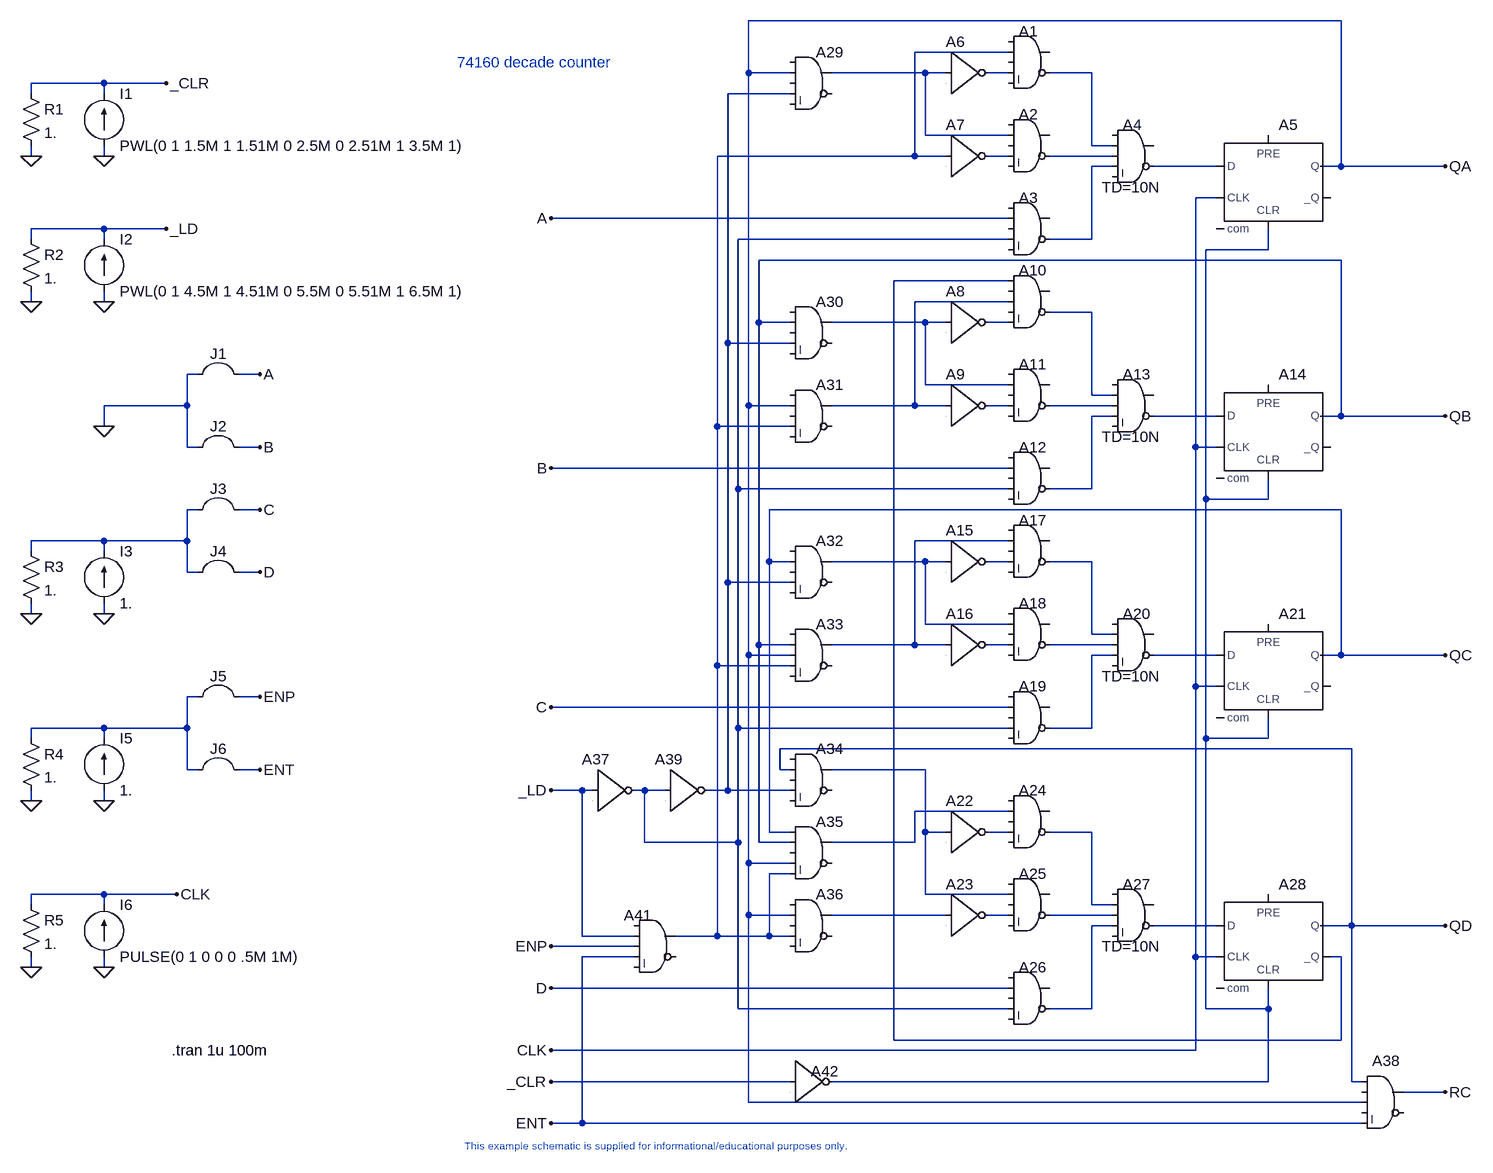
[diagram p0: schematic 160.asc]
160.asc, the LTspice schematic file:
Version 4
SHEET 1 2604 1992
WIRE 2384 208 1472 208
WIRE 1872 256 1728 256
WIRE 1472 288 1472 208
WIRE 1536 288 1472 288
WIRE 1744 288 1600 288
WIRE 1776 288 1744 288
WIRE 1872 288 1840 288
WIRE 2000 288 1936 288
WIRE 480 304 368 304
WIRE 576 304 480 304
WIRE 368 320 368 304
WIRE 480 320 480 304
WIRE 1536 320 1440 320
WIRE 1744 384 1744 288
WIRE 1872 384 1744 384
WIRE 2000 400 2000 288
WIRE 2032 400 2000 400
WIRE 368 416 368 400
WIRE 480 416 480 400
WIRE 1728 416 1728 256
WIRE 1728 416 1424 416
WIRE 1776 416 1728 416
WIRE 1872 416 1840 416
WIRE 2032 416 1936 416
WIRE 2032 432 2000 432
WIRE 2192 432 2096 432
WIRE 2384 432 2384 208
WIRE 2384 432 2352 432
WIRE 2544 432 2384 432
WIRE 2192 480 2160 480
WIRE 1872 512 1168 512
WIRE 480 528 368 528
WIRE 576 528 480 528
WIRE 368 544 368 528
WIRE 480 544 480 528
WIRE 1872 544 1456 544
WIRE 2000 544 2000 432
WIRE 2000 544 1936 544
WIRE 2272 560 2272 528
WIRE 2272 560 2176 560
WIRE 2384 576 1488 576
WIRE 1872 608 1696 608
WIRE 368 640 368 624
WIRE 480 640 480 624
WIRE 1872 640 1728 640
WIRE 2000 656 1936 656
WIRE 1488 672 1488 576
WIRE 1536 672 1488 672
WIRE 1744 672 1600 672
WIRE 1776 672 1744 672
WIRE 1872 672 1840 672
WIRE 1440 704 1440 320
WIRE 1536 704 1440 704
WIRE 624 752 608 752
WIRE 720 752 688 752
WIRE 1744 768 1744 672
WIRE 1872 768 1744 768
WIRE 2000 784 2000 656
WIRE 2032 784 2000 784
WIRE 608 800 608 752
WIRE 608 800 480 800
WIRE 1472 800 1472 288
WIRE 1536 800 1472 800
WIRE 1728 800 1728 640
WIRE 1728 800 1600 800
WIRE 1776 800 1728 800
WIRE 1872 800 1840 800
WIRE 2032 800 1936 800
WIRE 2032 816 2000 816
WIRE 2192 816 2096 816
WIRE 2384 816 2384 576
WIRE 2384 816 2352 816
WIRE 2544 816 2384 816
WIRE 480 832 480 800
WIRE 1424 832 1424 416
WIRE 1536 832 1424 832
WIRE 608 864 608 800
WIRE 624 864 608 864
WIRE 720 864 688 864
WIRE 2160 864 2160 480
WIRE 2192 864 2160 864
WIRE 1872 896 1168 896
WIRE 1456 928 1456 544
WIRE 1872 928 1456 928
WIRE 2000 928 2000 816
WIRE 2000 928 1936 928
WIRE 2176 944 2176 560
WIRE 2272 944 2272 912
WIRE 2272 944 2176 944
WIRE 624 960 608 960
WIRE 720 960 688 960
WIRE 2384 960 1504 960
WIRE 480 1008 368 1008
WIRE 608 1008 608 960
WIRE 608 1008 480 1008
WIRE 1872 1008 1728 1008
WIRE 368 1024 368 1008
WIRE 480 1024 480 1008
WIRE 1504 1040 1504 960
WIRE 1536 1040 1504 1040
WIRE 1744 1040 1600 1040
WIRE 1776 1040 1744 1040
WIRE 1872 1040 1840 1040
WIRE 2000 1040 1936 1040
WIRE 608 1056 608 1008
WIRE 624 1056 608 1056
WIRE 720 1056 688 1056
WIRE 1440 1072 1440 704
WIRE 1536 1072 1440 1072
WIRE 368 1120 368 1104
WIRE 480 1120 480 1104
WIRE 1744 1136 1744 1040
WIRE 1872 1136 1744 1136
WIRE 2000 1152 2000 1040
WIRE 2032 1152 2000 1152
WIRE 1488 1168 1488 672
WIRE 1536 1168 1488 1168
WIRE 1728 1168 1728 1008
WIRE 1728 1168 1600 1168
WIRE 1776 1168 1728 1168
WIRE 1872 1168 1840 1168
WIRE 2032 1168 1936 1168
WIRE 1472 1184 1472 800
WIRE 1536 1184 1472 1184
WIRE 2032 1184 2000 1184
WIRE 2192 1184 2096 1184
WIRE 2384 1184 2384 960
WIRE 2384 1184 2352 1184
WIRE 2544 1184 2384 1184
WIRE 1424 1200 1424 832
WIRE 1536 1200 1424 1200
WIRE 2160 1232 2160 864
WIRE 2192 1232 2160 1232
WIRE 624 1248 608 1248
WIRE 720 1248 688 1248
WIRE 1872 1264 1168 1264
WIRE 480 1296 368 1296
WIRE 608 1296 608 1248
WIRE 608 1296 480 1296
WIRE 1456 1296 1456 928
WIRE 1872 1296 1456 1296
WIRE 2000 1296 2000 1184
WIRE 2000 1296 1936 1296
WIRE 368 1312 368 1296
WIRE 480 1312 480 1296
WIRE 2176 1312 2176 944
WIRE 2272 1312 2272 1280
WIRE 2272 1312 2176 1312
WIRE 2400 1328 1520 1328
WIRE 608 1360 608 1296
WIRE 624 1360 608 1360
WIRE 720 1360 688 1360
WIRE 1520 1360 1520 1328
WIRE 1536 1360 1520 1360
WIRE 1744 1360 1600 1360
WIRE 1216 1392 1168 1392
WIRE 1232 1392 1216 1392
WIRE 1312 1392 1296 1392
WIRE 1344 1392 1312 1392
WIRE 1440 1392 1440 1072
WIRE 1440 1392 1408 1392
WIRE 1536 1392 1440 1392
WIRE 368 1408 368 1392
WIRE 480 1408 480 1392
WIRE 1872 1424 1728 1424
WIRE 1504 1456 1504 1040
WIRE 1536 1456 1504 1456
WIRE 1744 1456 1744 1360
WIRE 1776 1456 1744 1456
WIRE 1872 1456 1840 1456
WIRE 2000 1456 1936 1456
WIRE 1312 1472 1312 1392
WIRE 1456 1472 1456 1296
WIRE 1456 1472 1312 1472
WIRE 1488 1472 1488 1168
WIRE 1536 1472 1488 1472
WIRE 1728 1472 1728 1424
WIRE 1728 1472 1600 1472
WIRE 1472 1504 1472 1184
WIRE 1536 1504 1472 1504
WIRE 1536 1520 1504 1520
WIRE 480 1552 368 1552
WIRE 592 1552 480 1552
WIRE 1744 1552 1744 1456
WIRE 1872 1552 1744 1552
WIRE 368 1568 368 1552
WIRE 480 1568 480 1552
WIRE 2000 1568 2000 1456
WIRE 2032 1568 2000 1568
WIRE 1472 1584 1472 1504
WIRE 1536 1584 1472 1584
WIRE 1776 1584 1600 1584
WIRE 1872 1584 1840 1584
WIRE 2032 1584 1936 1584
WIRE 2032 1600 2000 1600
WIRE 2192 1600 2096 1600
WIRE 2400 1600 2400 1328
WIRE 2400 1600 2352 1600
WIRE 2544 1600 2400 1600
WIRE 1216 1616 1216 1392
WIRE 1296 1616 1216 1616
WIRE 1424 1616 1424 1200
WIRE 1424 1616 1360 1616
WIRE 1504 1616 1504 1520
WIRE 1504 1616 1424 1616
WIRE 1536 1616 1504 1616
WIRE 1296 1632 1168 1632
WIRE 1296 1648 1216 1648
WIRE 2160 1648 2160 1232
WIRE 2192 1648 2160 1648
WIRE 2384 1648 2368 1648
WIRE 368 1664 368 1648
WIRE 480 1664 480 1648
WIRE 1872 1696 1168 1696
WIRE 1456 1728 1456 1472
WIRE 1872 1728 1456 1728
WIRE 2000 1728 2000 1600
WIRE 2000 1728 1936 1728
WIRE 2176 1728 2176 1312
WIRE 2272 1728 2272 1696
WIRE 2272 1728 2176 1728
WIRE 1696 1776 1696 608
WIRE 2384 1776 2384 1648
WIRE 2384 1776 1696 1776
WIRE 2160 1792 2160 1648
WIRE 2160 1792 1168 1792
WIRE 1536 1840 1168 1840
WIRE 2272 1840 2272 1728
WIRE 2272 1840 1600 1840
WIRE 2400 1840 2400 1600
WIRE 2416 1840 2400 1840
WIRE 2544 1856 2480 1856
WIRE 1472 1872 1472 1584
WIRE 2416 1872 1472 1872
WIRE 1216 1904 1216 1648
WIRE 1216 1904 1168 1904
WIRE 2416 1904 1216 1904
FLAG 2544 432 QA
FLAG 2544 816 QB
FLAG 2544 1184 QC
FLAG 2544 1600 QD
FLAG 2544 1856 RC
FLAG 368 1664 0
FLAG 480 1664 0
FLAG 480 832 0
FLAG 368 1120 0
FLAG 480 1120 0
FLAG 368 1408 0
FLAG 480 1408 0
FLAG 368 640 0
FLAG 480 640 0
FLAG 368 416 0
FLAG 480 416 0
FLAG 1168 1840 _CLR
FLAG 576 304 _CLR
FLAG 1168 512 A
FLAG 720 752 A
FLAG 720 864 B
FLAG 1168 896 B
FLAG 720 960 C
FLAG 1168 1264 C
FLAG 1168 1392 _LD
FLAG 576 528 _LD
FLAG 720 1248 ENP
FLAG 1168 1632 ENP
FLAG 720 1056 D
FLAG 1168 1696 D
FLAG 592 1552 CLK
FLAG 1168 1792 CLK
FLAG 720 1360 ENT
FLAG 1168 1904 ENT
SYMBOL CURRENT 480 1648 M180
WINDOW 0 24 80 Left 2
WINDOW 3 24 0 Left 2
SYMATTR InstName I6
SYMATTR Value PULSE(0 1 0 0 0 .5M 1M)
SYMBOL CURRENT 480 1104 M180
WINDOW 0 24 80 Left 2
WINDOW 3 24 0 Left 2
SYMATTR InstName I3
SYMATTR Value 1.
SYMBOL CURRENT 480 1392 M180
WINDOW 0 24 80 Left 2
WINDOW 3 24 0 Left 2
SYMATTR InstName I5
SYMATTR Value 1.
SYMBOL CURRENT 480 624 M180
WINDOW 0 24 80 Left 2
WINDOW 3 24 0 Left 2
SYMATTR InstName I2
SYMATTR Value PWL(0 1 4.5M 1 4.51M 0 5.5M 0 5.51M 1 6.5M 1)
SYMBOL CURRENT 480 400 M180
WINDOW 0 24 80 Left 2
WINDOW 3 24 0 Left 2
SYMATTR InstName I1
SYMATTR Value PWL(0 1 1.5M 1 1.51M 0 2.5M 0 2.51M 1 3.5M 1)
SYMBOL MISC\\JUMPER 656 1296 R0
SYMATTR InstName J6
SYMBOL MISC\\JUMPER 656 1184 R0
SYMATTR InstName J5
SYMBOL MISC\\JUMPER 656 992 R0
SYMATTR InstName J4
SYMBOL MISC\\JUMPER 656 896 R0
SYMATTR InstName J3
SYMBOL MISC\\JUMPER 656 800 R0
SYMATTR InstName J2
SYMBOL MISC\\JUMPER 656 688 R0
SYMATTR InstName J1
SYMBOL RES 352 1552 R0
SYMATTR InstName R5
SYMATTR Value 1.
SYMBOL RES 352 1008 R0
SYMATTR InstName R3
SYMATTR Value 1.
SYMBOL RES 352 1296 R0
SYMATTR InstName R4
SYMATTR Value 1.
SYMBOL RES 352 528 R0
SYMATTR InstName R2
SYMATTR Value 1.
SYMBOL RES 352 304 R0
SYMATTR InstName R1
SYMATTR Value 1.
SYMBOL DIGITAL\\INV 1344 1328 R0
WINDOW 0 -16 16 Left 2
WINDOW 3 -16 96 Left 2
SYMATTR InstName A39
SYMBOL DIGITAL\\INV 1232 1328 R0
WINDOW 0 -16 16 Left 2
WINDOW 3 -16 96 Left 2
SYMATTR InstName A37
SYMBOL DIGITAL\\INV 1536 1776 R0
WINDOW 0 32 48 Left 2
WINDOW 3 32 80 Left 2
SYMATTR InstName A42
SYMBOL DIGITAL\\INV 1776 1520 R0
WINDOW 0 0 16 Left 2
WINDOW 3 -16 96 Left 2
SYMATTR InstName A23
SYMBOL DIGITAL\\INV 1776 1392 R0
WINDOW 0 0 16 Left 2
WINDOW 3 -16 96 Left 2
SYMATTR InstName A22
SYMBOL DIGITAL\\INV 1776 976 R0
WINDOW 0 0 16 Left 2
WINDOW 3 -16 96 Left 2
SYMATTR InstName A15
SYMBOL DIGITAL\\INV 1776 1104 R0
WINDOW 0 0 16 Left 2
WINDOW 3 -16 96 Left 2
SYMATTR InstName A16
SYMBOL DIGITAL\\INV 1776 736 R0
WINDOW 0 0 16 Left 2
WINDOW 3 -16 96 Left 2
SYMATTR InstName A9
SYMBOL DIGITAL\\INV 1776 608 R0
WINDOW 0 0 16 Left 2
WINDOW 3 -16 96 Left 2
SYMATTR InstName A8
SYMBOL DIGITAL\\INV 1776 352 R0
WINDOW 0 0 16 Left 2
WINDOW 3 -16 96 Left 2
SYMATTR InstName A7
SYMBOL DIGITAL\\INV 1776 224 R0
WINDOW 0 0 16 Left 2
WINDOW 3 -16 96 Left 2
SYMATTR InstName A6
SYMBOL DIGITAL\\AND 2448 1808 R0
WINDOW 0 -16 0 Left 2
WINDOW 3 -16 112 Left 2
SYMATTR InstName A38
SYMBOL DIGITAL\\AND 1328 1568 R0
WINDOW 0 -48 16 Left 2
SYMATTR InstName A41
SYMBOL DIGITAL\\AND 1568 240 R0
SYMATTR InstName A29
SYMBOL DIGITAL\\AND 1904 208 R0
WINDOW 0 -16 16 Left 2
WINDOW 3 0 112 Left 2
SYMATTR InstName A1
SYMBOL DIGITAL\\AND 1904 464 R0
WINDOW 0 -16 16 Left 2
WINDOW 3 0 112 Left 2
SYMATTR InstName A3
SYMBOL DIGITAL\\AND 1904 336 R0
WINDOW 0 -16 16 Left 2
WINDOW 3 0 112 Left 2
SYMATTR InstName A2
SYMBOL DIGITAL\\AND 2064 352 R0
WINDOW 0 -16 16 Left 2
WINDOW 3 -48 112 Left 2
SYMATTR InstName A4
SYMATTR Value TD=10N
SYMBOL DIGITAL\\AND 1904 576 R0
WINDOW 0 -16 16 Left 2
WINDOW 3 0 112 Left 2
SYMATTR InstName A10
SYMBOL DIGITAL\\AND 1568 752 R0
SYMATTR InstName A31
SYMBOL DIGITAL\\AND 1568 624 R0
SYMATTR InstName A30
SYMBOL DIGITAL\\AND 1904 848 R0
WINDOW 0 -16 16 Left 2
WINDOW 3 0 112 Left 2
SYMATTR InstName A12
SYMBOL DIGITAL\\AND 1904 720 R0
WINDOW 0 -16 16 Left 2
WINDOW 3 0 112 Left 2
SYMATTR InstName A11
SYMBOL DIGITAL\\AND 2064 736 R0
WINDOW 0 -16 16 Left 2
WINDOW 3 -48 112 Left 2
SYMATTR InstName A13
SYMATTR Value TD=10N
SYMBOL DIGITAL\\AND 1568 1120 R0
SYMATTR InstName A33
SYMBOL DIGITAL\\AND 1568 992 R0
SYMATTR InstName A32
SYMBOL DIGITAL\\AND 1904 960 R0
WINDOW 0 -16 16 Left 2
WINDOW 3 0 112 Left 2
SYMATTR InstName A17
SYMBOL DIGITAL\\AND 1904 1216 R0
WINDOW 0 -16 16 Left 2
WINDOW 3 0 112 Left 2
SYMATTR InstName A19
SYMBOL DIGITAL\\AND 1904 1088 R0
WINDOW 0 -16 16 Left 2
WINDOW 3 0 112 Left 2
SYMATTR InstName A18
SYMBOL DIGITAL\\AND 2064 1104 R0
WINDOW 0 -16 16 Left 2
WINDOW 3 -48 112 Left 2
SYMATTR InstName A20
SYMATTR Value TD=10N
SYMBOL DIGITAL\\AND 1904 1648 R0
WINDOW 0 -16 16 Left 2
WINDOW 3 0 112 Left 2
SYMATTR InstName A26
SYMBOL DIGITAL\\AND 1568 1424 R0
SYMATTR InstName A35
SYMBOL DIGITAL\\AND 1568 1312 R0
SYMATTR InstName A34
SYMBOL DIGITAL\\AND 1568 1536 R0
SYMATTR InstName A36
SYMBOL DIGITAL\\AND 1904 1376 R0
WINDOW 0 -16 16 Left 2
WINDOW 3 0 112 Left 2
SYMATTR InstName A24
SYMBOL DIGITAL\\AND 1904 1504 R0
WINDOW 0 -16 16 Left 2
WINDOW 3 0 112 Left 2
SYMATTR InstName A25
SYMBOL DIGITAL\\AND 2064 1520 R0
WINDOW 0 -16 16 Left 2
WINDOW 3 -48 112 Left 2
SYMATTR InstName A27
SYMATTR Value TD=10N
SYMBOL DIGITAL\\DFLOP 2272 384 R0
WINDOW 0 16 -16 Left 2
WINDOW 3 16 160 Left 2
SYMATTR InstName A5
SYMBOL DIGITAL\\DFLOP 2272 768 R0
WINDOW 0 16 -16 Left 2
WINDOW 3 16 160 Left 2
SYMATTR InstName A14
SYMBOL DIGITAL\\DFLOP 2272 1136 R0
WINDOW 0 16 -16 Left 2
WINDOW 3 16 160 Left 2
SYMATTR InstName A21
SYMBOL DIGITAL\\DFLOP 2272 1552 R0
WINDOW 0 16 -16 Left 2
WINDOW 3 16 160 Left 2
SYMATTR InstName A28
TEXT 1144 272 Center 2 ;74160 decade counter
TEXT 584 1792 Left 2 !.tran 1u 100m
TEXT 1320 1928 Top 1 ;This example schematic is supplied for informational/educational purposes only.

The netlist it stands for:
* 160.asc
I6 0 CLK PULSE(0 1 0 0 0 .5M 1M)
I3 0 D 1.
I5 0 ENT 1.
I2 0 _LD PWL(0 1 4.5M 1 4.51M 0 5.5M 0 5.51M 1 6.5M 1)
I1 0 _CLR PWL(0 1 1.5M 1 1.51M 0 2.5M 0 2.51M 1 3.5M 1)
R5 CLK 0 1.
R3 D 0 1.
R4 ENT 0 1.
R2 _LD 0 1.
R1 _CLR 0 1.
A39 N010 0 0 0 0 N005 0 0 BUF
A37 _LD 0 0 0 0 N010 0 0 BUF
A42 _CLR 0 0 0 0 N011 0 0 BUF
A23 N033 0 0 0 0 N034 0 0 BUF
A22 N029 0 0 0 0 N031 0 0 BUF
A15 N022 0 0 0 0 N023 0 0 BUF
A16 N021 0 0 0 0 N025 0 0 BUF
A9 N013 0 0 0 0 N017 0 0 BUF
A8 N015 0 0 0 0 N016 0 0 BUF
A7 N001 0 0 0 0 N006 0 0 BUF
A6 N002 0 0 0 0 N003 0 0 BUF
A38 QD 0 QA 0 ENT 0 RC 0 AND
A41 0 _LD ENT ENT 0 0 N001 0 AND
A29 0 QA 0 N005 0 0 N002 0 AND
A1 0 N001 0 N003 0 N004 0 0 AND
A3 0 0 0 N010 0 N008 0 0 AND
A2 0 N002 0 N006 0 N007 0 0 AND
A4 0 N004 N007 N008 0 N009 0 0 AND TD=10N
A10 N012 0 N013 0 N016 N014 0 0 AND
A31 0 QA 0 N001 0 0 N013 0 AND
A30 0 QB 0 N005 0 0 N015 0 AND
A12 0 0 0 N010 0 N019 0 0 AND
A11 0 N015 0 N017 0 N018 0 0 AND
A13 0 N014 N018 N019 0 N020 0 0 AND TD=10N
A33 0 QB QA N001 0 0 N021 0 AND
A32 0 QC 0 N005 0 0 N022 0 AND
A17 0 N021 0 N023 0 N024 0 0 AND
A19 0 D 0 N010 0 N027 0 0 AND
A18 0 N022 0 N025 0 N026 0 0 AND
A20 0 N024 N026 N027 0 N028 0 0 AND TD=10N
A26 0 D 0 N010 0 N036 0 0 AND
A35 QC QB 0 QA N001 0 N030 0 AND
A34 0 QD 0 N005 0 0 N029 0 AND
A36 0 QA 0 N001 0 0 N033 0 AND
A24 0 N030 0 N031 0 N032 0 0 AND
A25 0 N029 0 N034 0 N035 0 0 AND
A27 0 N032 N035 N036 0 N037 0 0 AND TD=10N
A5 N009 0 CLK 0 N011 0 QA 0 DFLOP
A14 N020 0 CLK 0 N011 0 QB 0 DFLOP
A21 N028 0 CLK 0 N011 0 QC 0 DFLOP
A28 N037 0 CLK 0 N011 N012 QD 0 DFLOP
* 74160 decade counter
.tran 1u 100m
* This example schematic is supplied for informational/educational purposes only.
.backanno
.end